# Altium schematic sheet Sensor_Board.SchDoc
size A3; SheetNumber: 6; SheetTotal: 6
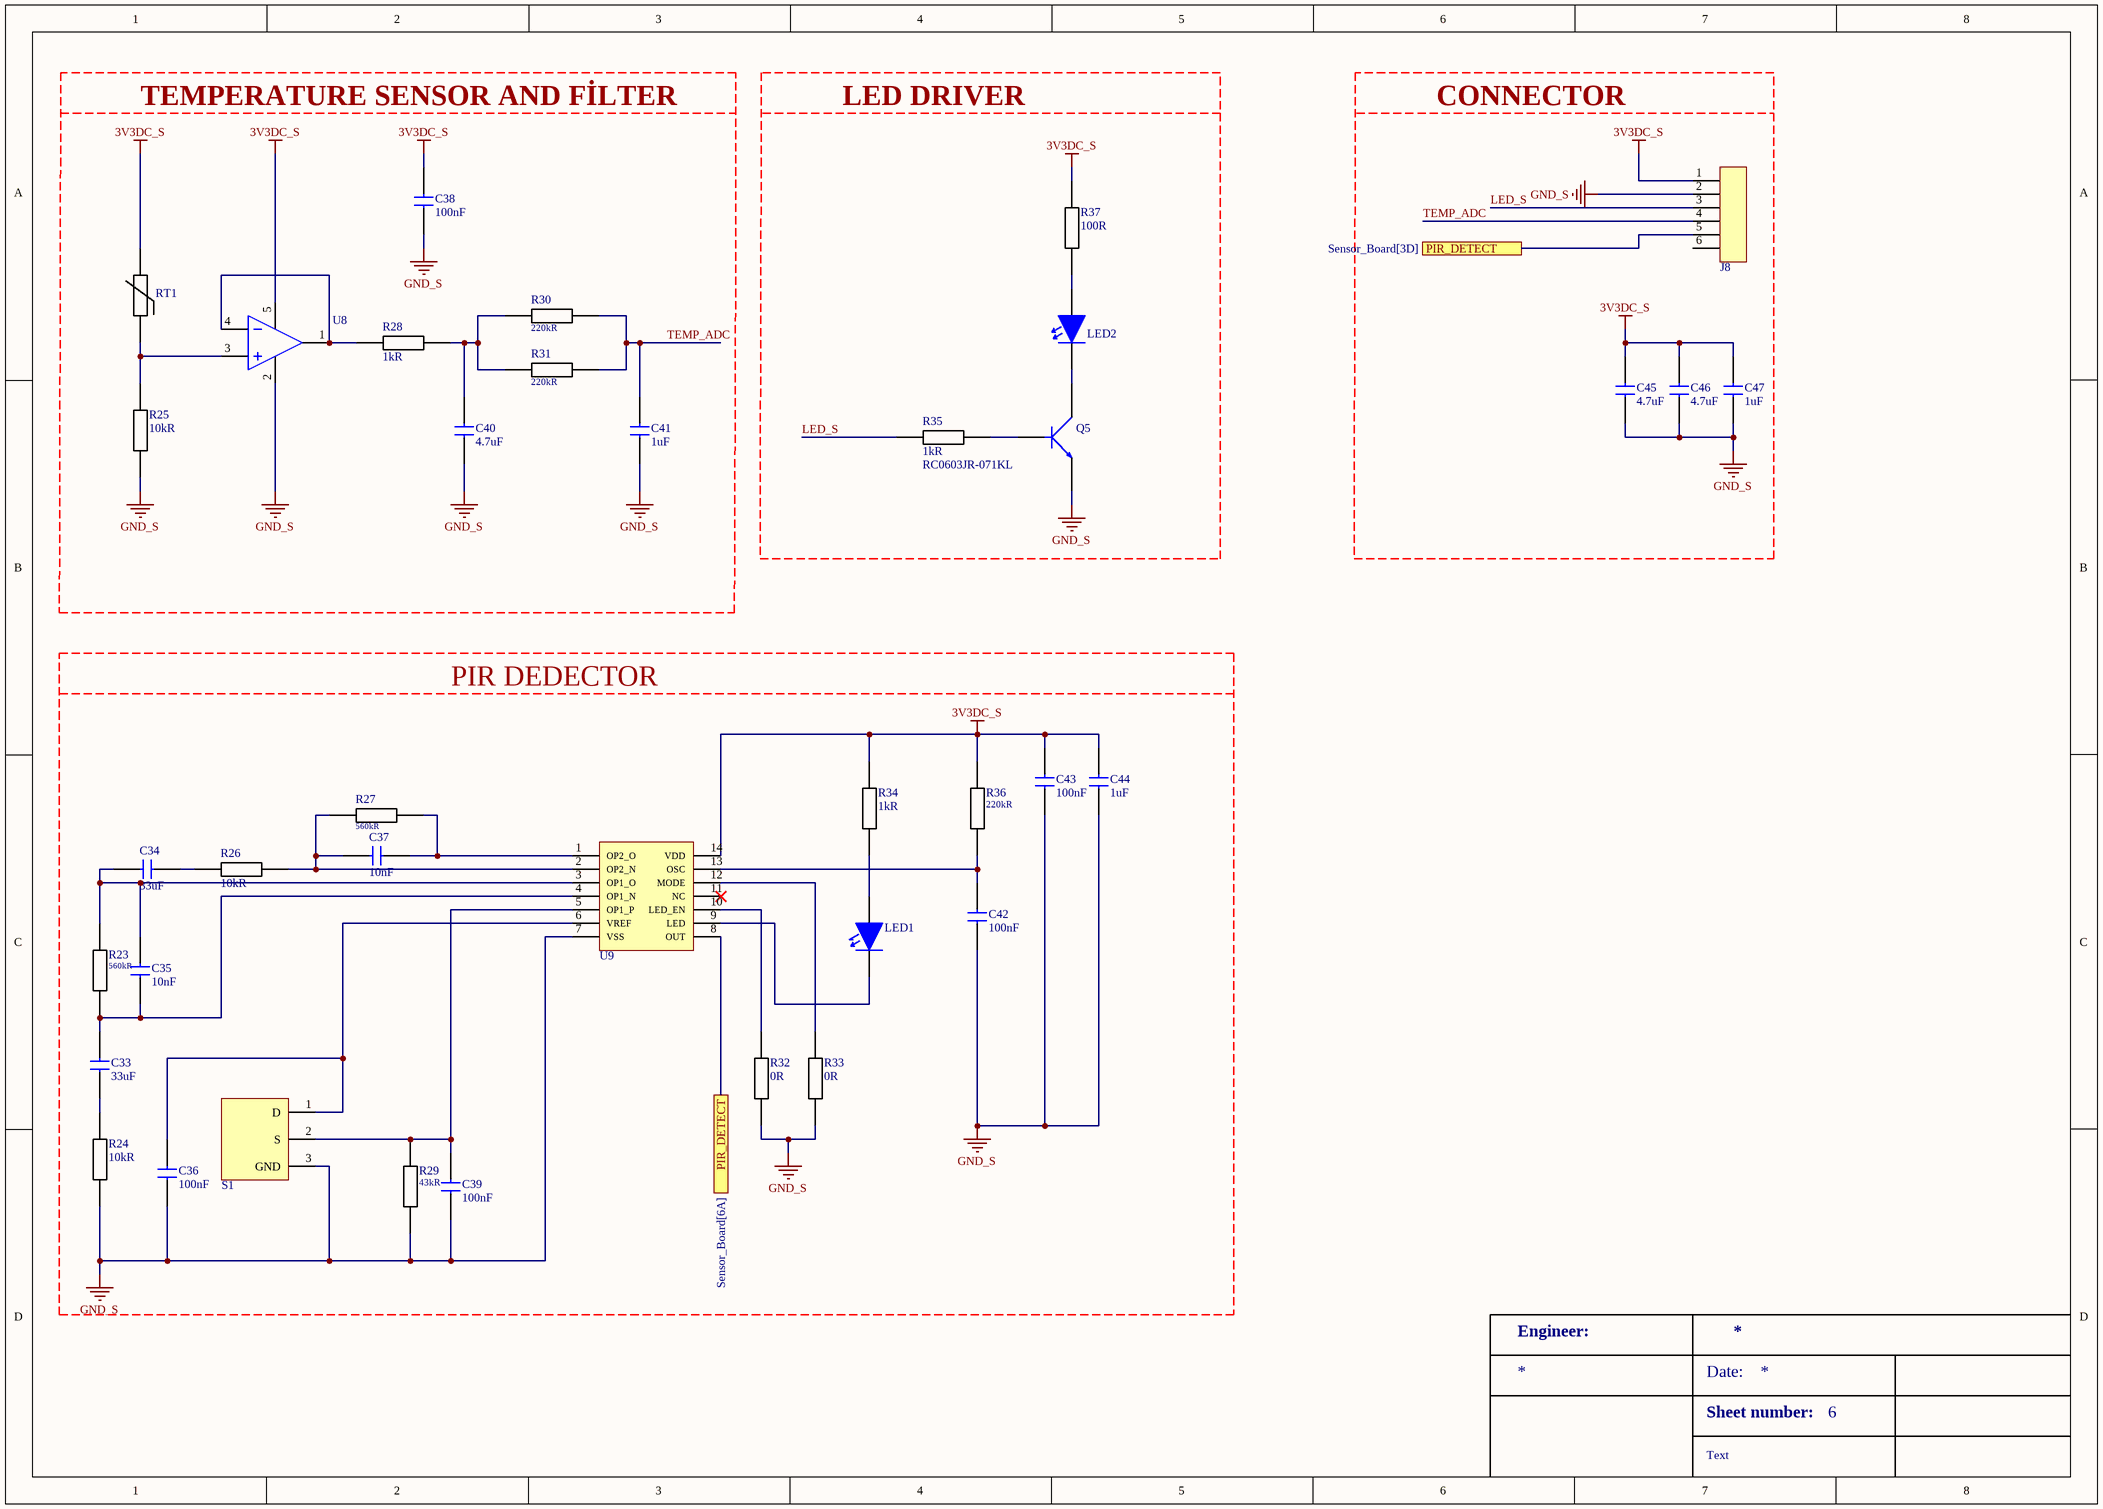
[diagram p0: Sensor_Board.SchDoc]

## Parts
C33  value 33uF  [CAP_1206]  (hidden comment: C3216X5R1E336M160AC)
C34  value 33uF  [CAP_1206]  (hidden comment: C3216X5R1E336M160AC)
C35  value 10nF  [CAP_0603]  (hidden comment: 0603B103K160CT)
C36  value 100nF  [CAP_0805]  (hidden comment: CL21B104KBCNNNC)
C37  value 10nF  [CAP_0603]  (hidden comment: 0603B103K160CT)
C38  value 100nF  [CAP_0805]  (hidden comment: CL21B104KBCNNNC)
C39  value 100nF  [CAP_0805]  (hidden comment: CL21B104KBCNNNC)
C40  value 4.7uF  [CAP_0805]  (hidden comment: CL21A475KAQNNNE)
C41  value 1uF  [CAP_0805]  (hidden comment: CHA08C105K4RXL7189)
C42  value 100nF  [CAP_0805]  (hidden comment: CL21B104KBCNNNC)
C43  value 100nF  [CAP_0805]  (hidden comment: CL21B104KBCNNNC)
C44  value 1uF  [CAP_0805]  (hidden comment: CHA08C105K4RXL7189)
C45  value 4.7uF  [CAP_0805]  (hidden comment: CL21A475KAQNNNE)
C46  value 4.7uF  [CAP_0805]  (hidden comment: CL21A475KAQNNNE)
C47  value 1uF  [CAP_0805]  (hidden comment: CHA08C105K4RXL7189)
J8  64800611622  [64800611622]  (value not drawn)
LED1  LTST-C171GKT  [LED_GREEN 0805]  (value not drawn)
LED2  LH R974-LP-1  [LED_RED 0805]  (value not drawn)
Q5  MMBT3904-7-F  [SOT-23F]  (value not drawn)
R23  value 560kR  [RES_0603]  (hidden comment: RC0603JR-07560KL)
R24  value 10kR  [RES_0603]  (hidden comment: RC0603FR-0710KL)
R25  value 10kR  [RES_0603]  (hidden comment: RC0603FR-0710KL)
R26  value 10kR  [RES_0603]  (hidden comment: RC0603FR-0710KL)
R27  value 560kR  [RES_0603]  (hidden comment: RC0603JR-07560KL)
R28  value 1kR  [RES_0603]  (hidden comment: RC0603JR-071KL)
R29  value 43kR  [RES_0603]  (hidden comment: RC0603JR-0743KL)
R30  value 220kR  [RES_0603]  (hidden comment: RC0603JR-07220KL)
R31  value 220kR  [RES_0603]  (hidden comment: RC0603JR-07220KL)
R32  value 0R  [RES_0603]  (hidden comment: RC0603JR-070RL)
R33  value 0R  [RES_0603]  (hidden comment: RC0603JR-070RL)
R34  value 1kR  [RES_0603]  (hidden comment: RC0603JR-071KL)
R35  RC0603JR-071KL  value 1kR  [RES_0603]
R36  value 220kR  [RES_0603]  (hidden comment: RC0603JR-07220KL)
R37  value 100R  [RES_0603]  (hidden comment: RC0603FR-07100RL)
RT1  TFPT 1206L1002FM  [RES-1206]  (value not drawn)
S1  LHI 878/3902  [LHI 878/3902]  (value not drawn)
U8  OPA314AIDBVR  [SOT23-5]  (value not drawn)
U9  NCS36000DRG  [SOIC14]  (value not drawn)

## Blocks framed on the sheet
TEMPERATURE SENSOR AND FİLTER: C38 C40 C41 R25 R28 R30 R31 RT1 U8
LED DRIVER: LED2 Q5 R35 R37
CONNECTOR: C45-C47 J8
PIR DEDECTOR: C33-C37 C39 C42-C44 LED1 R23 R24 R26 R27 R29 R32-R34 R36 S1 U9

## Ports
PIR_DETECT (see Sensor_Board[3D]), PIR_DETECT (see Sensor_Board[6A])

## Nets
3V3DC_S: C38.2 C43.2 C44.2 C45.2 C46.2 C47.2 J8.1 R34.2 R36.1 R37.2 RT1.2 U8.5 U9.14(VDD)
GND_S: C36.1 C38.1 C39.1 C40.1 C41.1 C42.1 C43.1 C44.1 C45.1 C46.1 C47.1 J8.2 Q5.2(E) R24.1 R25.1 R29.1 R32.1 R33.1 S1.3(GND) U8.2 U9.7(VSS)
LED_S: J8.3 R35.1
PIR_DETECT: J8.5 U9.8(OUT) ; port PIR_DETECT
TEMP_ADC: C41.2 J8.4 R30.2 R31.2
NetC33_1: C33.1 R24.2
NetC33_2: C33.2 C35.1 R23.1 U9.4(OP1_N)
NetC34_1: C34.1 C35.2 R23.2 U9.3(OP1_O)
NetC34_2: C34.2 R26.1
NetC36_2: C36.2 S1.1(D) U9.6(VREF)
NetC37_1: C37.1 R26.2 R27.1 U9.2(OP2_N)
NetC37_2: C37.2 R27.2 U9.1(OP2_O)
NetC39_2: C39.2 R29.2 S1.2(S) U9.5(OP1_P)
NetC40_2: C40.2 R28.2 R30.1 R31.1
NetC42_2: C42.2 R36.2 U9.13(OSC)
NetLED1_1: LED1.1 U9.9(LED)
NetLED1_2: LED1.2 R34.1
NetLED2_1: LED2.1 Q5.3(C)
NetLED2_2: LED2.2 R37.1
NetQ5_1: Q5.1(B) R35.2
NetR25_2: R25.2 RT1.1 U8.3
NetR28_1: R28.1 U8.1 U8.4
NetR32_2: R32.2 U9.10(LED_EN)
NetR33_2: R33.2 U9.12(MODE)

Not connected (* = marked no-connect by the designer): J8 6; U9 11(NC)*

## Notes on the sheet
- Engineer:
- Date:
- Sheet number:
- Text

## Library data of the parts
C33 C34 = CAP_CER_33uF_1206: Ceramic Capacitor, 25V, 20% 33uF, Surface Mount, 1206; Manufacturer: TDK; Multilayer: Yes; Temperature Characteristics Code: X5R; Designed by: Kerem; Supplier: Digikey; Supplier Part Number: 445-8046-1-ND; Manufacturer Part Number: C3216X5R1E336M160AC; RoHS: Yes; Category: Ceramic Capacitors; Stock: 198956; Pricing: 1=1,18, 10=0,77, 100=0,5474, 1000=0,4191 (USD); Mounting Technology: Surface Mount; Pins: 2; Dielectric Material: Ceramic; Package Shape: Rectangular; Case/Package: 1206; Terminal Finish: Nickel; Min Operating Temperature: -55°C; Max Operating Temperature: 85°C; JESD-609 Code: e3; Capacitor Type: Ceramic; Tolerance  (fill in as +-): 20%; Package Style: SMTMeter; Packaging: Tape and Reel; Tolerance (fill in as +-): 20%; Rated DC Voltage (URdc): 25V; Termination: Wraparound; Length: 3.2mm; Width: 1.6mm; Height: 1.6mm; Reach SVHC Compliant: Yes; RoHS Compliant: Yes; ComponentLink1URL: https://datasheet.ciiva.com:443/pdfs/VipMasterIC/IC/TDKC/TDKC-S-A0008796792/TDKC-S-A0008796792-1.pdf?src-supplier=IHS+Markit; ComponentLink1Description: https://datasheet.ciiva.com:443/pdfs/VipMasterIC/IC/TDKC/TDKC-S-A0008796792/TDKC-S-A0008796792-1.pdf?src-supplier=IHS+Markit; ComponentLink2URL: https://datasheet.ciiva.com/24216/c3216x5r1e336m160ac-265051-24216512.pdf?src-supplier=Mouser; ComponentLink2Description: https://datasheet.ciiva.com/24216/c3216x5r1e336m160ac-265051-24216512.pdf?src-supplier=Mouser; ComponentLink3URL: https://datasheet.ciiva.com/6285/tdkmlcccaprange-6285278.pdf?src-supplier=Digikey; ComponentLink3Description: https://datasheet.ciiva.com/6285/tdkmlcccaprange-6285278.pdf?src-supplier=Digikey
C35 C37 = CAP_CER_10nF_0603: Ceramic Capacitor,16V, 10%, 0.01uF, Surface Mount, 0603; Manufacturer: Walsin Technologies; Designed by: Kerem; Multilayer: Yes; Temperature Characteristics Code: X7R; Supplier: Digikey; Supplier Part Number: 1292-1384-6-ND; Manufacturer Part Number: 0603B103K160CT; RoHS: Yes; Category: Ceramic Capacitors; Stock: 40006; Pricing: 1=0,1, 10=0,031, 50=0,018, 100=0,0139, 500=0,0105, 1000=0,00825 (USD); Mounting Technology: Surface Mount; Pins: 2; Dielectric Material: Ceramic; Case/Package: 0603; Package Shape: Rectangular; Terminal Finish: Nickel; Min Operating Temperature: -55°C; Max Operating Temperature: 125°C; Capacitor Type: Ceramic; Tolerance  (fill in as +-): 10%; Package Style: SMTMeter; Packaging: Tape and Reel; Tolerance (fill in as +-): 10%; Rated DC Voltage (URdc): 16V; JESD-609 Code: e3; Termination: Wraparound; Length: 1.6mm; Width: 0.8mm; Height: 0.8mm; Reach SVHC Compliant: Yes; RoHS Compliant: Yes; ComponentLink1URL: https://datasheet.ciiva.com:443/pdfs/VipMasterIC/IC/WATC/WATC-S-A0009550342/WATC-S-A0009550342-1.pdf?src-supplier=IHS+Markit; ComponentLink1Description: https://datasheet.ciiva.com:443/pdfs/VipMasterIC/IC/WATC/WATC-S-A0009550342/WATC-S-A0009550342-1.pdf?src-supplier=IHS+Markit; ComponentLink2URL: http://www.farnell.com/datasheets/1958513.pdf?src-supplier=Farnell; ComponentLink2Description: http://www.farnell.com/datasheets/1958513.pdf?src-supplier=Farnell; ComponentLink3URL: https://datasheet.octopart.com/0603B103K160CT-Walsin-Technologies-datasheet-85392065.pdf?src-supplier=Element14; ComponentLink3Description: https://datasheet.octopart.com/0603B103K160CT-Walsin-Technologies-datasheet-85392065.pdf?src-supplier=Element14; ComponentLink4URL: http://www.passivecomponent.com/wp-content/uploads/2018/10/MLCC.pdf?src-supplier=Digikey; ComponentLink4Description: http://www.passivecomponent.com/wp-content/uploads/2018/10/MLCC.pdf?src-supplier=Digikey; ComponentLink5URL: https://datasheet.octopart.com/0603B103K160CT-Walsin-Technologies-datasheet-136037192.pdf?src-supplier=Future+Electronics; ComponentLink5Description: https://datasheet.octopart.com/0603B103K160CT-Walsin-Technologies-datasheet-136037192.pdf?src-supplier=Future+Electronics; ComponentLink6URL: https://datasheet.octopart.com/0603B103K160CT-Walsin-Technologies-datasheet-62066062.pdf?src-supplier=TME; ComponentLink6Description: https://datasheet.octopart.com/0603B103K160CT-Walsin-Technologies-datasheet-62066062.pdf?src-supplier=TME
C36 C38 C39 C42 C43 = CAP_CER_100nF_0805: Ceramic Capacitor,50V, %10, 0.1uF, Surface Mount, 0805; Manufacturer: Samsung; Multilayer: Yes; Tolerance  (fill in as +-): 10%; Temperature Characteristics Code: X7R; Designed by: Kerem; Supplier: Digikey; Supplier Part Number: 1276-1003-1-ND; Manufacturer Part Number: CL21B104KBCNNNC; RoHS: Yes; Category: Ceramic Capacitors; Stock: 925106; Pricing: 1=0,1, 10=0,029, 100=0,0175, 1000=0,01156 (USD); Mounting Technology: Surface Mount; Pins: 2; Dielectric Material: Ceramic; Package Shape: Rectangular; Case/Package: 0805; Terminal Finish: Nickel; Min Operating Temperature: -55°C; Max Operating Temperature: 125°C; JESD-609 Code: e3; Capacitor Type: Ceramic; Package Style: SMTMeter; Packaging: Tape and Reel; Tolerance (fill in as +-): 10%; Rated DC Voltage (URdc): 50V; Termination: Wraparound; Length: 2mm; Width: 1.25mm; Height: 0.95mm; Reach SVHC Compliant: Yes; RoHS Compliant: Yes; ComponentLink1URL: https://datasheet.ciiva.com:443/pdfs/VipMasterIC/IC/SEMS/SEMS-S-A0008521003/SEMS-S-A0008521039-1.pdf?src-supplier=IHS+Markit; ComponentLink1Description: https://datasheet.ciiva.com:443/pdfs/VipMasterIC/IC/SEMS/SEMS-S-A0008521003/SEMS-S-A0008521039-1.pdf?src-supplier=IHS+Markit; ComponentLink2URL: https://datasheet.ciiva.com/25710/cl21b104kbcnnnc-25710182.pdf?src-supplier=Digikey; ComponentLink2Description: https://datasheet.ciiva.com/25710/cl21b104kbcnnnc-25710182.pdf?src-supplier=Digikey; ComponentLink3URL: https://datasheet.ciiva.com/29199/454152-da-01-en-vs-kondensator-0805-29199814.pdf?src-supplier=Conrad; ComponentLink3Description: https://datasheet.ciiva.com/29199/454152-da-01-en-vs-kondensator-0805-29199814.pdf?src-supplier=Conrad
C40 C45 C46 = CAP_CER_4.7uF_0805: CAP CER 4.7uF,%10, Surface Mount, 0805; Manufacturer: Samsung; Designed by: Kerem; Dielectric Material: Ceramic; Multilayer: Yes; Tolerance  (fill in as +-): 10%; Rated DC Voltage (URdc): 25V; Temperature Characteristics Code: X5R; Supplier: Digikey; Supplier Part Number: 1276-1244-1-ND; Manufacturer Part Number: CL21A475KAQNNNE; RoHS: Yes; Category: Ceramic Capacitors; Stock: 2727040; Pricing: 1=0,1, 10=0,048, 100=0,03, 1000=0,02035 (USD); Mounting Technology: Surface Mount; Pins: 2; Package Shape: Rectangular; Case/Package: 0805; Terminal Finish: Nickel; Min Operating Temperature: -55°C; Max Operating Temperature: 85°C; JESD-609 Code: e3; Capacitor Type: Ceramic; Package Style: SMTMeter; Packaging: Tape and Reel; Tolerance (fill in as +-): 10%; Termination: Wraparound; Length: 2mm; Width: 1.25mm; Height: 1.4mm; Reach SVHC Compliant: Yes; RoHS Compliant: Yes; ComponentLink1URL: https://datasheet.ciiva.com:443/pdfs/VipMasterIC/IC/SEMS/SEMS-S-A0008528919/SEMS-S-A0008528938-1.pdf?src-supplier=IHS+Markit; ComponentLink1Description: https://datasheet.ciiva.com:443/pdfs/VipMasterIC/IC/SEMS/SEMS-S-A0008528919/SEMS-S-A0008528938-1.pdf?src-supplier=IHS+Markit; ComponentLink2URL: https://datasheet.ciiva.com/25798/cl21a475kaqnnne-25798882.pdf?src-supplier=Digikey; ComponentLink2Description: https://datasheet.ciiva.com/25798/cl21a475kaqnnne-25798882.pdf?src-supplier=Digikey
C41 C44 C47 = CAP_CER_1uF_0805: Cap CER, 1uF, 16V, 0805;; Manufacturer: KEMET; Designed by: Kerem; Supplier: Digikey; Supplier Part Number: 399-CHA08C105K4RXL7189DKR-ND; Manufacturer Part Number: CHA08C105K4RXL7189; Stock: 600; Pricing: 1=8,82, 10=6,341, 100=4,9085 (USD); ComponentLink1URL: https://datasheet.octopart.com/CHA08C105K4RXL7189-KEMET-datasheet-181963755.pdf?src-supplier=Farnell; ComponentLink1Description: https://datasheet.octopart.com/CHA08C105K4RXL7189-KEMET-datasheet-181963755.pdf?src-supplier=Farnell
J8 = 64800611622_CONN_6PINS: WR-WTB Wire-to-Board Connectors 1.50 mm; Manufacturer: Wurth Electronics; Designed by: Kerem; Supplier: Digikey; Supplier Part Number: 732-64800611622-ND; Manufacturer Part Number: 64800611622; RoHS: No; Category: Uncategorized; Stock: 1237; Pricing: 1=0,38, 50=0,3654, 100=0,3456, 250=0,32492, 500=0,3051 (USD)
LED1 = LED_GREEN_0805: Single Color LED, Green, Water Clear, 1.4mm; Manufacturer: Vishay Lite-On; Shape: Rectangular; Forward Current: 30mA; Forward Voltage: 2.6V; Luminous Intensity-Nom: 12mcd; Channels: 1; Reverse Voltage-Max: 5V; Viewing Angle: 130°; Overall Height: 0.8mm; Designed by: Kerem; Supplier: Digikey; Supplier Part Number: 160-1423-1-ND; Manufacturer Part Number: LTST-C171GKT; RoHS: Yes; Category: LEDs; Stock: 463604; Pricing: 1=0,22, 10=0,121, 100=0,0725, 500=0,0536, 1000=0,04781, 3000=0,04084, 6000=0,03738, 9000=0,03565, 15000=0,03374, 21000=0,03263, 30000=0,03157, 75000=0,02928, 150000=0,0279, 300000=0,02678 (USD); Mounting Technology: Surface Mount; Pins: 2; Color: Green; Color@wavelength: Green; Terminal Finish: Gold; Min Operating Temperature: -55°C; Max Operating Temperature: 85°C; JESD-609 Code: e4; Lens Style: WATER CLEAR; Optoelectronic Device Type: SINGLE COLOR LED; Packaging: Tape and Reel; Size: 1.4mm; Terminal Pitch: 2.5mm; Reach SVHC Compliant: Yes; RoHS Compliant: Yes; ComponentLink1URL: https://datasheet.ciiva.com:443/pdfs/VipMasterIC/IC/LITE/LITES06193/LITES06193-1.pdf?src-supplier=IHS+Markit; ComponentLink1Description: https://datasheet.ciiva.com:443/pdfs/VipMasterIC/IC/LITE/LITES06193/LITES06193-1.pdf?src-supplier=IHS+Markit; ComponentLink2URL: https://datasheet.ciiva.com/2110/ltst-c171gkt-2110000.pdf?src-supplier=Digikey; ComponentLink2Description: https://datasheet.ciiva.com/2110/ltst-c171gkt-2110000.pdf?src-supplier=Digikey; ComponentLink3URL: https://datasheet.ciiva.com/11773/0900766b80dc0296-11773991.pdf?src-supplier=Rs; ComponentLink3Description: https://datasheet.ciiva.com/11773/0900766b80dc0296-11773991.pdf?src-supplier=Rs; ComponentLink4URL: https://datasheet.ciiva.com/12400/lite-on-ltst-c171gkt-190133-12400647.pdf?src-supplier=Mouser; ComponentLink4Description: https://datasheet.ciiva.com/12400/lite-on-ltst-c171gkt-190133-12400647.pdf?src-supplier=Mouser; ComponentLink5URL: https://datasheet.ciiva.com/2110/ltst-c171gkt-2110001.pdf?src-supplier=Digikey; ComponentLink5Description: https://datasheet.ciiva.com/2110/ltst-c171gkt-2110001.pdf?src-supplier=Digikey; ComponentLink6URL: https://datasheet.ciiva.com/2110/ltst-c171gkt-2110002.pdf?src-supplier=Digikey; ComponentLink6Description: https://datasheet.ciiva.com/2110/ltst-c171gkt-2110002.pdf?src-supplier=Digikey; ComponentLink7URL: https://datasheet.ciiva.com/16396/ltst-c171gkt-16396549.pdf?src-supplier=Future+Electronics; ComponentLink7Description: https://datasheet.ciiva.com/16396/ltst-c171gkt-16396549.pdf?src-supplier=Future+Electronics
LED2 = LED_RED_0805: Designed by: Kerem
Q5 = MMBT3904-7-F: Small Signal Bipolar Transistor, 0.2A I(C), 40V V(BR)CEO, 1-Element, NPN, Silicon; Manufacturer: Diodes Zetex; Designed by: Kerem; Package Body Material: Plastic; Additional Feature: HIGH RELIABILITY; Max Collector Current: 200mA; DC Current Gain-Min (hFE): 30; Number of Elements: 1; Power Dissipation-Max (Abs): 300mW; Time @ Peak Reflow Temperature-Max (s): 40s; Transistor Application: SWITCHING; Frequency: 300MHz; Turn-off Time-Max (toff): 250ns; Turn-on Time-Max (ton): 70ns; Qualification Status: Not Qualified; Supplier: Digikey; Supplier Part Number: MMBT3904-FDICT-ND; Manufacturer Part Number: MMBT3904-7-F; RoHS: Yes; Category: BJTs; Stock: 3621103; Pricing: 1=0,12, 10=0,075, 100=0,0458, 500=0,03304, 1000=0,02888 (USD); Pins: 3; Package Shape: Rectangular; Terminal Finish: Tin; Transistor Element Material: SILICON; Max Operating Temperature: 150°C; JESD-609 Code: e3; Polarity/Channel Type: NPN; Collector-emitter Voltage-Max: 40V; JESD-30 Code: R-PDSO-G3; Moisture Sensitivity Level: 1; Package Style: SMALL OUTLINEMeter; Peak Reflow Temperature (Cel): 260°C; Surface Mount: Yes; Terminal Form: Gull Wing; Terminal Position: DUAL; Reach SVHC Compliant: Yes; RoHS Compliant: Yes; ComponentLink1URL: https://datasheet.ciiva.com:443/pdfs/VipMasterIC/IC/DIOD/DIOD-S-A0003133141/DIOD-S-A0003133141-1.pdf?src-supplier=IHS+Markit; ComponentLink1Description: https://datasheet.ciiva.com:443/pdfs/VipMasterIC/IC/DIOD/DIOD-S-A0003133141/DIOD-S-A0003133141-1.pdf?src-supplier=IHS+Markit; ComponentLink2URL: https://datasheet.ciiva.com/11201/ds30036-11201778.pdf?src-supplier=Avnet; ComponentLink2Description: https://datasheet.ciiva.com/11201/ds30036-11201778.pdf?src-supplier=Avnet; ComponentLink3URL: https://datasheet.ciiva.com/15138/getdatasheetpartid-53265-15138780.pdf?src-supplier=Verical; ComponentLink3Description: https://datasheet.ciiva.com/15138/getdatasheetpartid-53265-15138780.pdf?src-supplier=Verical; ComponentLink4URL: https://datasheet.ciiva.com/22711/1915516-22711750.pdf?src-supplier=Element14; ComponentLink4Description: https://datasheet.ciiva.com/22711/1915516-22711750.pdf?src-supplier=Element14; ComponentLink5URL: https://datasheet.ciiva.com/11198/ds30036-11198999.pdf?src-supplier=Avnet; ComponentLink5Description: https://datasheet.ciiva.com/11198/ds30036-11198999.pdf?src-supplier=Avnet; ComponentLink6URL: https://datasheet.ciiva.com/6361/ds30036-6361256.pdf?src-supplier=Digikey; ComponentLink6Description: https://datasheet.ciiva.com/6361/ds30036-6361256.pdf?src-supplier=Digikey; ComponentLink7URL: https://datasheet.ciiva.com/6361/ds30036-6361254.pdf?src-supplier=Digikey; ComponentLink7Description: https://datasheet.ciiva.com/6361/ds30036-6361254.pdf?src-supplier=Digikey
R23 R27 = RES_560K OHM_0603: 0.1W, 560000ohm, 75V, 5%, Surface Mount, 0603; Manufacturer: Yageo; Additional Feature: LASER TRIMMABLE; Power: 100mW; Rated Temperature: 70°C; Temperature Coefficient (ppm/Cel): 100; Package Height: 0.45mm; Package Length: 1.6mm; Package Width: 0.8mm; Designed by: Kerem; Supplier: Digikey; Supplier Part Number: 311-560KGRCT-ND; Manufacturer Part Number: RC0603JR-07560KL; RoHS: Yes; Category: Chip SMD Resistors; Stock: 397671; Pricing: 1=0,1, 10=0,008, 50=0,0066, 100=0,0051, 500=0,00438 (USD); Mounting Technology: Surface Mount; Pins: 2; Package Shape: Rectangular; Case/Package: 0603; Terminal Finish: Nickel; Min Operating Temperature: -55°C; Max Operating Temperature: 155°C; Tolerance: 5%; JESD-609 Code: e3; Resistor Type: FIXED RESISTOR; Construction: Chip; Packaging: Tape and Reel; Technology: METAL GLAZE/THICK FILM; Termination: Wraparound; Working Voltage: 75V; Reach SVHC Compliant: Yes; RoHS Compliant: Yes; ComponentLink1URL: https://datasheet.ciiva.com:443/pdfs/VipMasterIC/IC/YAGO/YAGO-S-A0008145938/YAGO-S-A0008145938-1.pdf?src-supplier=IHS+Markit; ComponentLink1Description: https://datasheet.ciiva.com:443/pdfs/VipMasterIC/IC/YAGO/YAGO-S-A0008145938/YAGO-S-A0008145938-1.pdf?src-supplier=IHS+Markit; ComponentLink2URL: https://datasheet.ciiva.com/2453/pyu-r-int-thick-7-2453056.pdf?src-supplier=Digikey; ComponentLink2Description: https://datasheet.ciiva.com/2453/pyu-r-int-thick-7-2453056.pdf?src-supplier=Digikey; ComponentLink3URL: https://datasheet.ciiva.com/2453/pyu-r-int-thick-7-2453057.pdf?src-supplier=Digikey; ComponentLink3Description: https://datasheet.ciiva.com/2453/pyu-r-int-thick-7-2453057.pdf?src-supplier=Digikey; ComponentLink4URL: https://datasheet.ciiva.com/2453/pyu-r-int-thick-7-2453055.pdf?src-supplier=Digikey; ComponentLink4Description: https://datasheet.ciiva.com/2453/pyu-r-int-thick-7-2453055.pdf?src-supplier=Digikey
R24-R26 = RES 10K OHM 0603: Fixed Resistor, Metal Glaze/thick Film, 0.1W, 10000ohm, 75V, 1% +/-Tol, 100ppm/Cel, Surface Mount, 0603; Manufacturer: Yageo; Additional Feature: LASER TRIMMABLE; Power: 100mW; Rated Temperature: 70°C; Temperature Coefficient (ppm/Cel): 100; Package Height: 0.45mm; Package Length: 1.6mm; Package Width: 0.8mm; Designed by: Kerem; Supplier: Digikey; Supplier Part Number: 311-10.0KHRCT-ND; Manufacturer Part Number: RC0603FR-0710KL; RoHS: Yes; Category: Chip SMD Resistors; Stock: 4804248; Pricing: 1=0,1, 10=0,009, 100=0,0082, 1000=0,00714, 2500=0,00663, 5000=0,00612, 10000=0,00263, 15000=0,00249, 25000=0,00221, 250000=0,00204, 500000=0,0019 (USD); Mounting Technology: Surface Mount; Pins: 2; Package Shape: Rectangular; Case/Package: 0603; Terminal Finish: Nickel; Min Operating Temperature: -55°C; Max Operating Temperature: 155°C; Tolerance: 1%; JESD-609 Code: e3; Resistor Type: FIXED RESISTOR; Construction: Chip; Packaging: Tape and Reel; Technology: METAL GLAZE/THICK FILM; Termination: Wraparound; Working Voltage: 75V; Reach SVHC Compliant: Yes; RoHS Compliant: Yes; ComponentLink1URL: https://datasheet.ciiva.com:443/pdfs/VipMasterIC/IC/YAGO/YAGO-S-A0008145938/YAGO-S-A0008145938-1.pdf?src-supplier=IHS+Markit; ComponentLink1Description: https://datasheet.ciiva.com:443/pdfs/VipMasterIC/IC/YAGO/YAGO-S-A0008145938/YAGO-S-A0008145938-1.pdf?src-supplier=IHS+Markit; ComponentLink2URL: https://datasheet.ciiva.com/46440/1868787-46440891.pdf?src-supplier=Element14; ComponentLink2Description: https://datasheet.ciiva.com/46440/1868787-46440891.pdf?src-supplier=Element14; ComponentLink3URL: https://datasheet.ciiva.com/7746/1738695-7746239.pdf?src-supplier=Element14; ComponentLink3Description: https://datasheet.ciiva.com/7746/1738695-7746239.pdf?src-supplier=Element14; ComponentLink4URL: https://datasheet.ciiva.com/7983/443971-7983596.pdf?src-supplier=Element14; ComponentLink4Description: https://datasheet.ciiva.com/7983/443971-7983596.pdf?src-supplier=Element14; ComponentLink5URL: https://datasheet.ciiva.com/7660/38590-7660789.pdf?src-supplier=Element14; ComponentLink5Description: https://datasheet.ciiva.com/7660/38590-7660789.pdf?src-supplier=Element14; ComponentLink6URL: https://datasheet.ciiva.com/22747/443971-22747519.pdf?src-supplier=Element14; ComponentLink6Description: https://datasheet.ciiva.com/22747/443971-22747519.pdf?src-supplier=Element14; ComponentLink7URL: https://datasheet.ciiva.com/15189/getdatasheetpartid-409289-15189591.pdf?src-supplier=Verical; ComponentLink7Description: https://datasheet.ciiva.com/15189/getdatasheetpartid-409289-15189591.pdf?src-supplier=Verical
R28 R34 R35 = RES_1K OHM_0603: 0.1W, 1000ohm, 75V, 5%, Surface Mount, 0603; Manufacturer: Yageo; Additional Feature: LASER TRIMMABLE; Power: 100mW; Rated Temperature: 70°C; Temperature Coefficient (ppm/Cel): 100; Package Height: 0.45mm; Package Length: 1.6mm; Package Width: 0.8mm; Designed by: Kerem; Supplier: Digikey; Supplier Part Number: 311-1.0KGRCT-ND; Manufacturer Part Number: RC0603JR-071KL; RoHS: Yes; Category: Chip SMD Resistors; Stock: 732542; Pricing: 1=0,1, 10=0,01, 50=0,0082, 100=0,0061, 500=0,0056, 1000=0,0051 (USD); Mounting Technology: Surface Mount; Pins: 2; Package Shape: Rectangular; Case/Package: 0603; Terminal Finish: Nickel; Min Operating Temperature: -55°C; Max Operating Temperature: 155°C; Tolerance: 5%; JESD-609 Code: e3; Resistor Type: FIXED RESISTOR; Construction: Chip; Packaging: Tape and Reel; Technology: METAL GLAZE/THICK FILM; Termination: Wraparound; Working Voltage: 75V; Reach SVHC Compliant: Yes; RoHS Compliant: Yes; ComponentLink1URL: https://datasheet.ciiva.com:443/pdfs/VipMasterIC/IC/YAGO/YAGO-S-A0008145938/YAGO-S-A0008145938-1.pdf?src-supplier=IHS+Markit; ComponentLink1Description: https://datasheet.ciiva.com:443/pdfs/VipMasterIC/IC/YAGO/YAGO-S-A0008145938/YAGO-S-A0008145938-1.pdf?src-supplier=IHS+Markit
R29 = RES_43K OHM_0603: 0.1W, 43000ohm, 75V, 5%, Surface Mount, 0603; Manufacturer: Yageo; Additional Feature: LASER TRIMMABLE; Power: 100mW; Rated Temperature: 70°C; Temperature Coefficient (ppm/Cel): 100; Package Height: 0.45mm; Package Length: 1.6mm; Package Width: 0.8mm; Designed by: Kerem; Supplier: Digikey; Supplier Part Number: 311-43KGRCT-ND; Manufacturer Part Number: RC0603JR-0743KL; RoHS: Yes; Category: Chip SMD Resistors; Stock: 164654; Pricing: 1=0,1, 10=0,005, 50=0,0046, 100=0,0044 (USD); Mounting Technology: Surface Mount; Pins: 2; Package Shape: Rectangular; Case/Package: 0603; Terminal Finish: Nickel; Min Operating Temperature: -55°C; Max Operating Temperature: 155°C; Tolerance: 5%; JESD-609 Code: e3; Resistor Type: FIXED RESISTOR; Construction: Chip; Packaging: Tape and Reel; Technology: METAL GLAZE/THICK FILM; Termination: Wraparound; Working Voltage: 75V; Reach SVHC Compliant: Yes; RoHS Compliant: Yes; ComponentLink1URL: https://datasheet.ciiva.com:443/pdfs/VipMasterIC/IC/YAGO/YAGO-S-A0008145938/YAGO-S-A0008145938-1.pdf?src-supplier=IHS+Markit; ComponentLink1Description: https://datasheet.ciiva.com:443/pdfs/VipMasterIC/IC/YAGO/YAGO-S-A0008145938/YAGO-S-A0008145938-1.pdf?src-supplier=IHS+Markit; ComponentLink2URL: https://datasheet.ciiva.com/2453/pyu-r-int-thick-7-2453052.pdf?src-supplier=Digikey; ComponentLink2Description: https://datasheet.ciiva.com/2453/pyu-r-int-thick-7-2453052.pdf?src-supplier=Digikey; ComponentLink3URL: https://datasheet.ciiva.com/2453/pyu-r-int-thick-7-2453053.pdf?src-supplier=Digikey; ComponentLink3Description: https://datasheet.ciiva.com/2453/pyu-r-int-thick-7-2453053.pdf?src-supplier=Digikey; ComponentLink4URL: https://datasheet.ciiva.com/2453/pyu-r-int-thick-7-2453054.pdf?src-supplier=Digikey; ComponentLink4Description: https://datasheet.ciiva.com/2453/pyu-r-int-thick-7-2453054.pdf?src-supplier=Digikey
R30 R31 R36 = RES_220K OHM_0603: 0.1W, 220000ohm, 75V, 5%, Surface Mount, 0603; Manufacturer: Yageo; Additional Feature: LASER TRIMMABLE; Power: 100mW; Rated Temperature: 70°C; Temperature Coefficient (ppm/Cel): 100; Package Height: 0.45mm; Package Length: 1.6mm; Package Width: 0.8mm; Designed by: Kerem; Supplier: Digikey; Supplier Part Number: 311-220KGRCT-ND; Manufacturer Part Number: RC0603JR-07220KL; RoHS: Yes; Category: Chip SMD Resistors; Stock: 571767; Pricing: 1=0,1, 10=0,008, 50=0,0072, 100=0,0061, 500=0,0056, 1000=0,0051 (USD); Mounting Technology: Surface Mount; Pins: 2; Package Shape: Rectangular; Case/Package: 0603; Terminal Finish: Nickel; Min Operating Temperature: -55°C; Max Operating Temperature: 155°C; Tolerance: 5%; JESD-609 Code: e3; Resistor Type: FIXED RESISTOR; Construction: Chip; Packaging: Tape and Reel; Technology: METAL GLAZE/THICK FILM; Termination: Wraparound; Working Voltage: 75V; Reach SVHC Compliant: Yes; RoHS Compliant: Yes; ComponentLink1URL: https://datasheet.ciiva.com:443/pdfs/VipMasterIC/IC/YAGO/YAGO-S-A0008145938/YAGO-S-A0008145938-1.pdf?src-supplier=IHS+Markit; ComponentLink1Description: https://datasheet.ciiva.com:443/pdfs/VipMasterIC/IC/YAGO/YAGO-S-A0008145938/YAGO-S-A0008145938-1.pdf?src-supplier=IHS+Markit; ComponentLink2URL: https://datasheet.ciiva.com/2452/pyu-r-int-thick-7-2452923.pdf?src-supplier=Digikey; ComponentLink2Description: https://datasheet.ciiva.com/2452/pyu-r-int-thick-7-2452923.pdf?src-supplier=Digikey; ComponentLink3URL: https://datasheet.ciiva.com/2452/pyu-r-int-thick-7-2452924.pdf?src-supplier=Digikey; ComponentLink3Description: https://datasheet.ciiva.com/2452/pyu-r-int-thick-7-2452924.pdf?src-supplier=Digikey; ComponentLink4URL: https://datasheet.ciiva.com/2452/pyu-r-int-thick-7-2452925.pdf?src-supplier=Digikey; ComponentLink4Description: https://datasheet.ciiva.com/2452/pyu-r-int-thick-7-2452925.pdf?src-supplier=Digikey
R32 R33 = RES_0 OHM_0603: Metal Glaze/thick Film, 0.1W, 0ohm, Surface Mount, 0603; Manufacturer: Yageo; Power: 100mW; Rated Temperature: 70°C; Package Height: 0.45mm; Package Length: 1.6mm; Package Width: 0.8mm; Designed by: Kerem; Supplier: Digikey; Supplier Part Number: 311-0.0GRCT-ND; Manufacturer Part Number: RC0603JR-070RL; RoHS: Yes; Category: Chip SMD Resistors; Stock: 2033519; Pricing: 1=0,1, 10=0,004 (USD); Mounting Technology: Surface Mount; Pins: 2; Package Shape: Rectangular; Case/Package: 0603; Terminal Finish: Nickel; Min Operating Temperature: -55°C; Max Operating Temperature: 155°C; JESD-609 Code: e3; Resistor Type: FIXED RESISTOR; Construction: Chip; Packaging: Tape and Reel; Technology: METAL GLAZE/THICK FILM; Termination: Wraparound; Reach SVHC Compliant: Yes; RoHS Compliant: Yes; ComponentLink1URL: https://datasheet.ciiva.com:443/pdfs/VipMasterIC/IC/YAGO/YAGO-S-A0008145938/YAGO-S-A0008145938-1.pdf?src-supplier=IHS+Markit; ComponentLink1Description: https://datasheet.ciiva.com:443/pdfs/VipMasterIC/IC/YAGO/YAGO-S-A0008145938/YAGO-S-A0008145938-1.pdf?src-supplier=IHS+Markit
R37 = RES_100 OHM_0603: 0.1W, 100ohm, 75V, 1% Surface Mount, 0603; Manufacturer: Yageo; Additional Feature: LASER TRIMMABLE; Power: 100mW; Rated Temperature: 70°C; Temperature Coefficient (ppm/Cel): 100; Package Height: 0.45mm; Package Length: 1.6mm; Package Width: 0.8mm; Designed by: Kerem; Supplier: Digikey; Supplier Part Number: 311-100HRTR-ND; Manufacturer Part Number: RC0603FR-07100RL; RoHS: Yes; Category: Chip SMD Resistors; Stock: 845000; Pricing: 5000=0,00306, 10000=0,00204, 15000=0,0019 (USD); Mounting Technology: Surface Mount; Pins: 2; Package Shape: Rectangular; Case/Package: 0603; Terminal Finish: Nickel; Min Operating Temperature: -55°C; Max Operating Temperature: 155°C; Tolerance: 1%; JESD-609 Code: e3; Resistor Type: FIXED RESISTOR; Construction: Chip; Packaging: Tape and Reel; Technology: METAL GLAZE/THICK FILM; Termination: Wraparound; Working Voltage: 75V; Reach SVHC Compliant: Yes; RoHS Compliant: Yes; ComponentLink1URL: https://datasheet.ciiva.com:443/pdfs/VipMasterIC/IC/YAGO/YAGO-S-A0008145938/YAGO-S-A0008145938-1.pdf?src-supplier=IHS+Markit; ComponentLink1Description: https://datasheet.ciiva.com:443/pdfs/VipMasterIC/IC/YAGO/YAGO-S-A0008145938/YAGO-S-A0008145938-1.pdf?src-supplier=IHS+Markit
RT1 = TFPT 1206L1002FM: PTC Thermistor, 10000ohm, Surface Mount 1206; Manufacturer: Vishay Dale; Designed by: Kerem; Tolerance: 1%; Rated AC Voltage (URac): 50V; Power: 125mW; Rated Temperature: 70°C; Value: 10kR; Thermistor Application: TEMPERATURE COMPENSATION; Supplier: Digikey; Supplier Part Number: 541-3533-1-ND; Manufacturer Part Number: TFPT1206L1002FM; RoHS: Yes; Category: Linear ICs; Stock: 6990; Pricing: 1=0,91, 5=0,776, 10=0,727, 25=0,6708, 50=0,6336, 100=0,6003, 500=0,5357, 1000=0,51262 (USD); Mounting Technology: Surface Mount; Pins: 2; Package Shape: Rectangular; Terminal Finish: Tin; Min Operating Temperature: -55°C; Max Operating Temperature: 150°C; JESD-609 Code: e3; Resistor Type: PTC THERMISTOR; Packaging: Tape and Reel; Terminal Placement: Dual Ended; Termination: Wraparound; Reach SVHC Compliant: Yes; RoHS Compliant: Yes; ComponentLink1URL: https://datasheet.ciiva.com:443/pdfs/VipMasterIC/IC/VISH/VISH-S-A0009735813/VISH-S-A0009735813-1.pdf?src-supplier=IHS+Markit; ComponentLink1Description: https://datasheet.ciiva.com:443/pdfs/VipMasterIC/IC/VISH/VISH-S-A0009735813/VISH-S-A0009735813-1.pdf?src-supplier=IHS+Markit; ComponentLink2URL: https://datasheet.ciiva.com/2852/tfpt-2852076.pdf?src-supplier=Digikey; ComponentLink2Description: https://datasheet.ciiva.com/2852/tfpt-2852076.pdf?src-supplier=Digikey; Case/Package: 1206
S1 = LHI 878/3902: Sensor Pyro Detector Dual Motion; Manufacturer: Excelitas Technology; Designed by: Kerem; Min Supply Voltage: 2V; Max Supply Voltage: 12V; Supplier: DİGİKEY; Supplier Part Number: 1601-LHI878/3902-ND; Manufacturer Part Number: LHI 878/3902; Category: Linear ICs; ComponentLink1Description: DATASHEET; ComponentLink1URL: file:///C:/Users/KEREM/Downloads/PYD_1388___7083_Dual_Element_Pyrodetector_Datasheet.pdf
U8 = OPA314: Operational Amplifier, 1 Func, 2500uV Offset-Max, CMOS, PDSO5; Manufacturer: Texas Instruments; Package Body Material: Plastic; Architecture: VOLTAGE-FEEDBACK; Average Bias Current-Max (IIB): 600pA; Bias Current-Max (IIB) @25C: 10pA; Common Mode Rejection Ratio-Min: 60dB; Common-mode Reject Ratio-Nom: 90dB; Frequency Compensation: YES; Input Offset Voltage-Max: 2.5mV; Low-Offset: No; Channels: 1; Package Equivalence Code: TSOP5/6,.11,37; Power Supplies: +-0.9/+-2.75/1.8/5.5V; Slew Rate: 1.5V/µs; Max Supply Current: 180uA; Supply Voltage Limit-Max: 7V; Nominal Supply Voltage: 5V; Unity Gain BW-Nom: 3MHz; Voltage Gain-Min: 31620; Qualification Status: Not Qualified; Designed by: Kerem; Supplier: Digikey; Supplier Part Number: 296-36699-1-ND; Manufacturer Part Number: OPA314AIDBVR; RoHS: Yes; Category: Amplifiers - Op Amps, Buffer, Instrumentation; Stock: 11097; Pricing: 1=1,03, 10=0,741, 25=0,6692, 100=0,5899, 250=0,55212, 500=0,52932, 1000=0,51057 (USD); Case/Package: LSSOP; Pins: 5; Package Shape: Rectangular; Terminal Finish: Nickel; Min Operating Temperature: -40°C; Max Operating Temperature: 125°C; JESD-609 Code: e4; Amplifier Type: OPERATIONAL AMPLIFIER; JESD-30 Code: R-PDSO-G5; Low-Bias: Yes; Micropower: Yes; Moisture Sensitivity Level: 2; Package Style: SMALL OUTLINE, LOW PROFILE, SHRINK PITCHMeter; Packaging: Tape and Reel; Peak Reflow Temperature (Cel): 260°C; Power: No; Programmable Power: No; Surface Mount: Yes; Technology: CMOS; Terminal Form: Gull Wing; Terminal Position: DUAL; Wideband: No; Length: 2.9mm; Width: 1.6mm; Height - Seated (Max): 1.45mm; Terminal Pitch: 0.95mm; Temperature Grade: AUTOMOTIVE; Reach SVHC Compliant: Yes; RoHS Compliant: Yes; ComponentLink1URL: https://www.ti.com:443/lit/ds/symlink/opa2314.pdf?src-supplier=IHS+Markit; ComponentLink1Description: https://www.ti.com:443/lit/ds/symlink/opa2314.pdf?src-supplier=IHS+Markit; ComponentLink2URL: https://datasheet.ciiva.com/14462/opa2314-14462006.pdf?src-supplier=Avnet; ComponentLink2Description: https://datasheet.ciiva.com/14462/opa2314-14462006.pdf?src-supplier=Avnet; ComponentLink3URL: https://datasheet.ciiva.com/29638/opa314-29638827.pdf?src-supplier=Digikey; ComponentLink3Description: https://datasheet.ciiva.com/29638/opa314-29638827.pdf?src-supplier=Digikey; ComponentLink4URL: https://datasheet.ciiva.com/14456/opa2314-14456281.pdf?src-supplier=Avnet; ComponentLink4Description: https://datasheet.ciiva.com/14456/opa2314-14456281.pdf?src-supplier=Avnet
U9 = NCS36000: PIR Controller Analog Circuit, 1 Func, CMOS, PDSO14; Manufacturer: ON Semiconductor; Package Body Material: Plastic; Channels: 1; Package Equivalence Code: SOP14,.25; Power Supplies: 3.3/5V; Max Supply Voltage: 5.75V; Min Supply Voltage: 3V; Nominal Supply Voltage: 5V; Qualification Status: Not Qualified; Designed by: Kerem; Supplier: Farnell; Supplier Part Number: 2531200RL; Manufacturer Part Number: NCS36000DRG; RoHS: Yes; Category: Amplifiers - Op Amps, Buffer, Instrumentation; Pricing: 100=0,468, 250=0,442, 500=0,414, 1000=0,326, 2500=0,29, 5000=0,282 (EUR); Case/Package: SOP; Pins: 14; Package Shape: Rectangular; Terminal Finish: Tin; Min Operating Temperature: -40°C; Max Operating Temperature: 85°C; JESD-609 Code: e3; Throw Configuration: ANALOG CIRCUIT; JESD-30 Code: R-PDSO-G14; Moisture Sensitivity Level: 2; Package Style: SMALL OUTLINEMeter; Surface Mount: Yes; Technology: CMOS; Terminal Form: Gull Wing; Terminal Position: DUAL; Length: 8.65mm; Width: 3.9mm; Height - Seated (Max): 1.75mm; Terminal Pitch: 1.27mm; Temperature Grade: INDUSTRIAL; Reach SVHC Compliant: Yes; RoHS Compliant: Yes; ComponentLink1URL: https://datasheet.ciiva.com:443/pdfs/VipMasterIC/IC/ONSM/ONSM-S-A0001345293/ONSM-S-A0001345293-1.pdf?src-supplier=IHS+Markit; ComponentLink1Description: https://datasheet.ciiva.com:443/pdfs/VipMasterIC/IC/ONSM/ONSM-S-A0001345293/ONSM-S-A0001345293-1.pdf?src-supplier=IHS+Markit; ComponentLink2URL: https://datasheet.ciiva.com/1781/ncs36000-d-1781637.pdf?src-supplier=Digikey; ComponentLink2Description: https://datasheet.ciiva.com/1781/ncs36000-d-1781637.pdf?src-supplier=Digikey; ComponentLink3URL: https://datasheet.ciiva.com/4763/ncs36000-d-89569-4763639.pdf?src-supplier=Mouser; ComponentLink3Description: https://datasheet.ciiva.com/4763/ncs36000-d-89569-4763639.pdf?src-supplier=Mouser; ComponentLink4URL: https://datasheet.ciiva.com/1781/ncs36000-d-1781638.pdf?src-supplier=Digikey; ComponentLink4Description: https://datasheet.ciiva.com/1781/ncs36000-d-1781638.pdf?src-supplier=Digikey; ComponentLink5URL: https://datasheet.ciiva.com/1781/ncs36000-d-1781639.pdf?src-supplier=Digikey; ComponentLink5Description: https://datasheet.ciiva.com/1781/ncs36000-d-1781639.pdf?src-supplier=Digikey; ComponentLink6URL: https://datasheet.ciiva.com/2965/ncs36000-d-2965212.pdf?src-supplier=Avnet; ComponentLink6Description: https://datasheet.ciiva.com/2965/ncs36000-d-2965212.pdf?src-supplier=Avnet; ComponentLink7URL: https://datasheet.ciiva.com/2966/ncs36000-d-2966525.pdf?src-supplier=Avnet; ComponentLink7Description: https://datasheet.ciiva.com/2966/ncs36000-d-2966525.pdf?src-supplier=Avnet